# Altium schematic sheet Cover.SchDoc
size A3; RelaseDate: 06.09.2021; ChangeDate: 13.09.2021; ApprovedBy: OLD SCHOOL; CheckedBy: UDEMY; Revision: AA; SheetNumber: 1; SheetTotal: 5; PreparedBy: M.Mesih ÇELİK; Department: R&D- Hardware; ReleaseDate: 06.09.2021; ChangedDate: 13.09.2021; Size: A3; RreparedBy: M.Mesih ÇELİK; BoardDescription: Wireless Security Detector
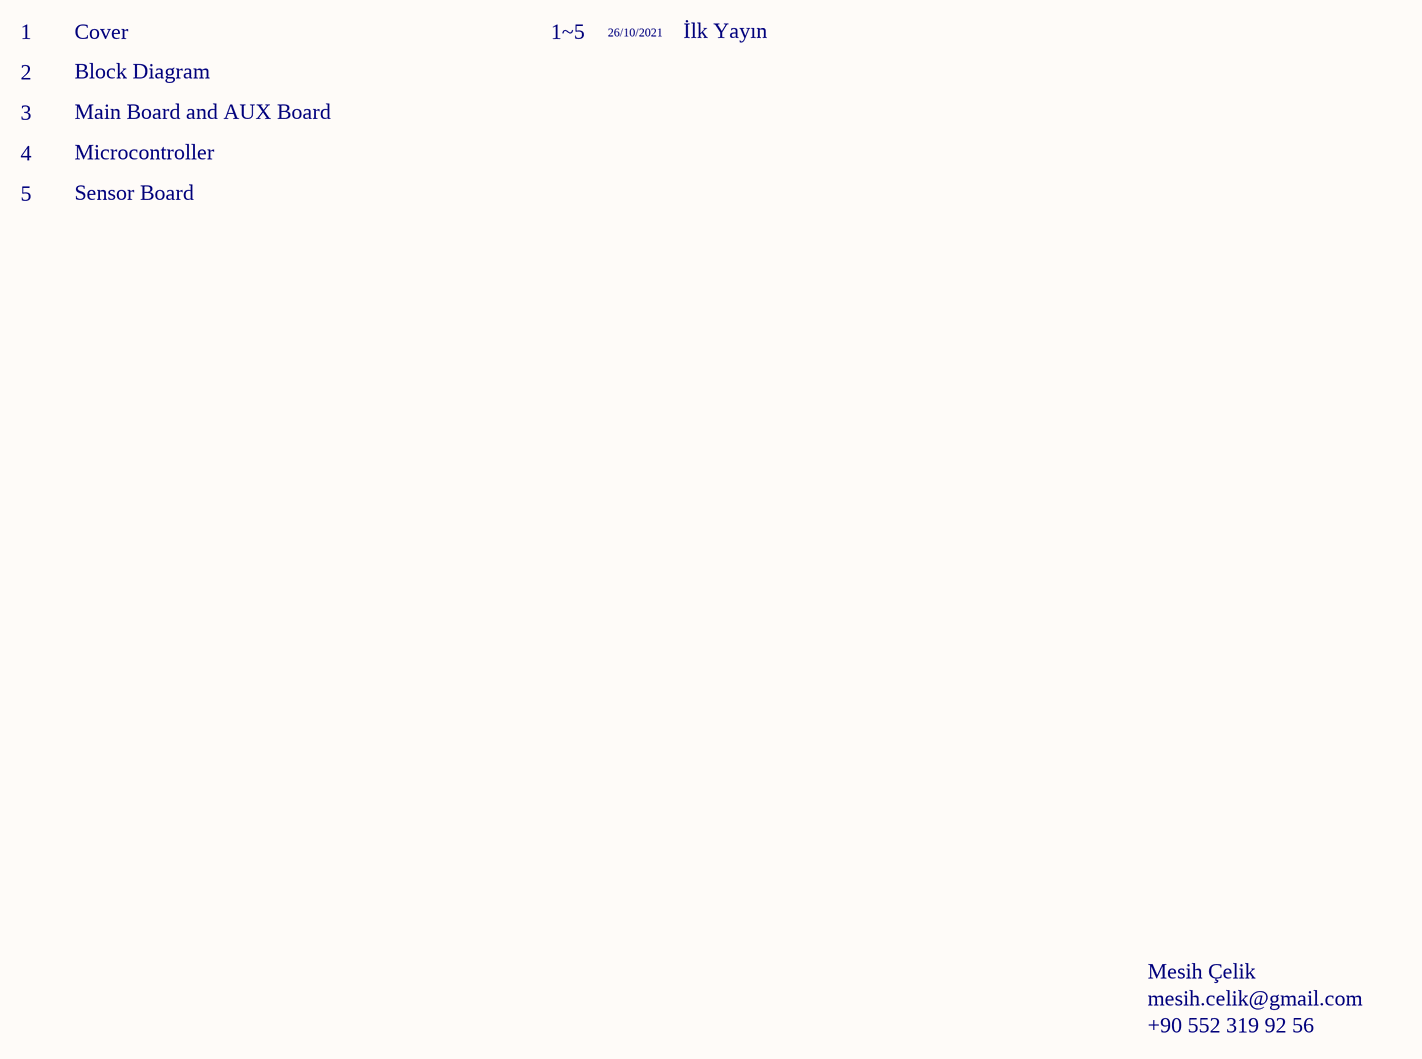
[diagram p0: Cover.SchDoc]

## Notes on the sheet
- 1
- Cover
- 1~5
- 26/10/2021
- İlk Yayın
- 2
- 3
- Block Diagram
- Main Board and AUX Board
- 4
- Microcontroller
- 5
- Sensor Board
- Mesih Çelik
- mesih.celik@gmail.com
- +90 552 319 92 56
- Sayfa Nu.
- İÇİNDEKİLER / CONTENTS
- Tarih
- REVİZYON / REVISION
- ÜRETİM NOTLARI / PRODUCTION NOTES
- Page No
- Açıklama / Description
- Date
- Kart Özellikleri
- Board Features
- Üretim Çıktıları
- Gerber Files
- Ekler
- Attachments
- İLETİŞİM / CONTACT
- DOSYA ADI / FILE NAME
- HAZIRLAYAN / PREPARED BY
- TANIM / DESCRIPTION
- YAYIN TARİHİ / REL. DATE
- ONAYLAYAN / APPROVED BY
- KONTROL EDEN / CHECKED BY
- BÖLÜM / DEPARTMENT
- BOYUT / SIZE
- DEĞ. TARİHİ / CHANGE DATE
- SAYFA / SHEET
- /